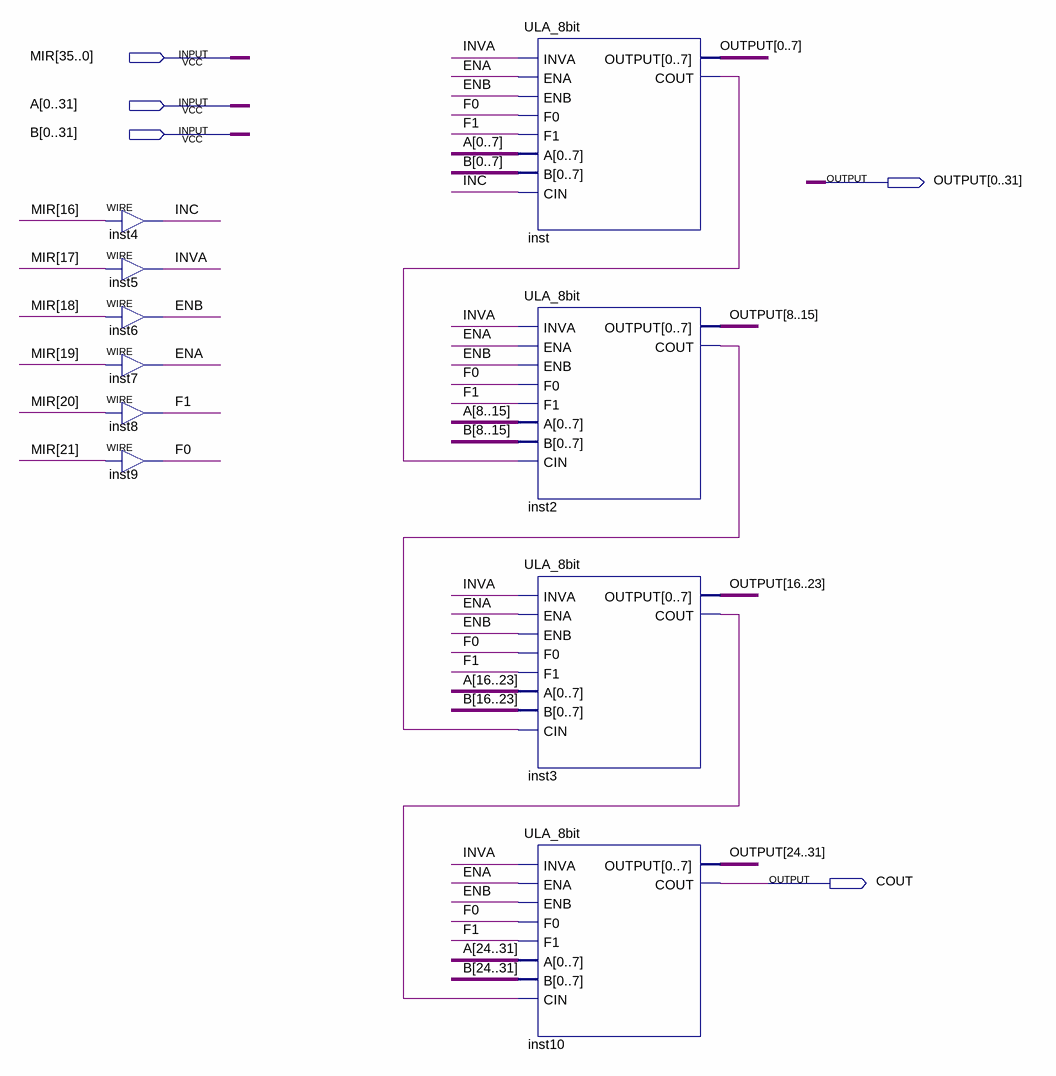
[diagram p0: schematic sheet]
// Quartus schematic ULA_32bit.bdf as structural Verilog: 10 symbols, 5 pins
module ULA_32bit (
  input  [35:0] MIR,
  input  [0:31] A,
  input  [0:31] B,
  output [0:31] OUTPUT,
  output COUT
);

  wire ENA, ENB, F0, F1, INC, inst2_cout, inst3_cout, inst_cout, INVA;

  assign INC = MIR[16];  // WIRE inst4
  assign INVA = MIR[17];  // WIRE inst5
  assign ENB = MIR[18];  // WIRE inst6
  assign ENA = MIR[19];  // WIRE inst7
  assign F1 = MIR[20];  // WIRE inst8
  assign F0 = MIR[21];  // WIRE inst9
  ULA_8bit inst (
    .INVA(INVA), .ENA(ENA), .ENB(ENB), .F0(F0), .F1(F1), .A(A[0:7]), .B(B[0:7]), .CIN(INC),
    .OUTPUT(OUTPUT[0:7]), .COUT(inst_cout));
  ULA_8bit inst2 (
    .INVA(INVA), .ENA(ENA), .ENB(ENB), .F0(F0), .F1(F1), .A(A[8:15]), .B(B[8:15]), .CIN(inst_cout),
    .OUTPUT(OUTPUT[8:15]), .COUT(inst2_cout));
  ULA_8bit inst3 (
    .INVA(INVA), .ENA(ENA), .ENB(ENB), .F0(F0), .F1(F1), .A(A[16:23]), .B(B[16:23]), .CIN(inst2_cout),
    .OUTPUT(OUTPUT[16:23]), .COUT(inst3_cout));
  ULA_8bit inst10 (
    .INVA(INVA), .ENA(ENA), .ENB(ENB), .F0(F0), .F1(F1), .A(A[24:31]), .B(B[24:31]), .CIN(inst3_cout),
    .OUTPUT(OUTPUT[24:31]), .COUT(COUT));
endmodule
